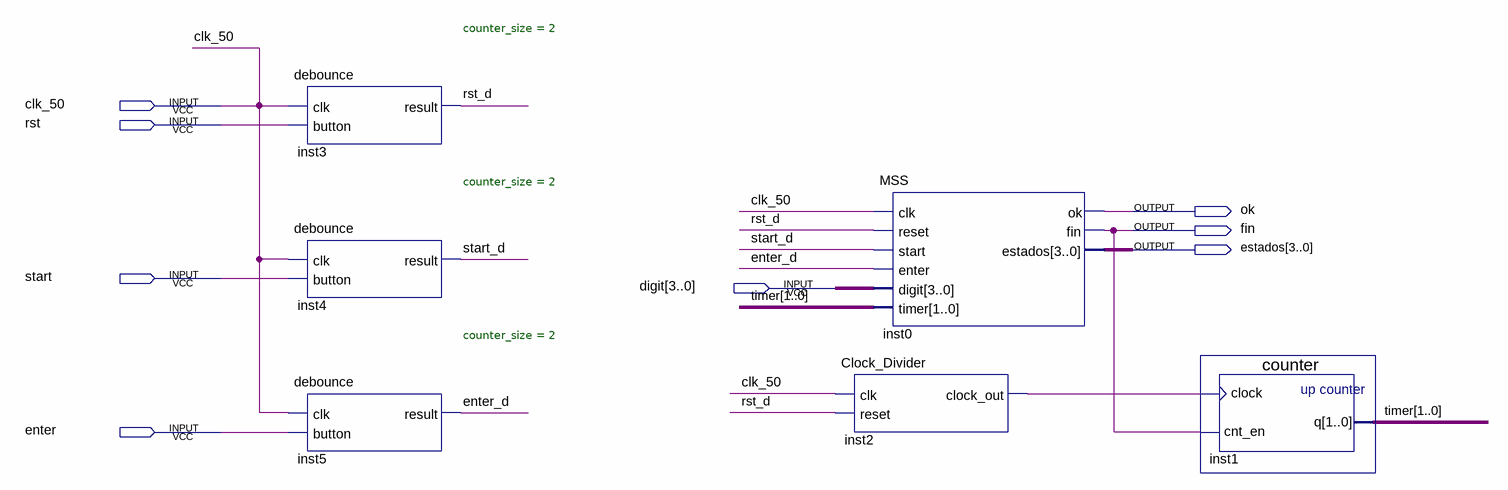
[diagram p0: schematic sheet]
// Quartus schematic VALIDACION.bdf as structural Verilog: 6 symbols, 8 pins
module VALIDACION (
  input  clk_50,
  input  rst,
  input  start,
  input  [3:0] digit,
  input  enter,
  output ok,
  output fin,
  output [3:0] estados
);

  wire enter_d, inst2_clock_out, rst_d, start_d;
  wire [1:0] timer;

  debounce #(.counter_size(2)) inst3 (.clk(clk_50), .button(rst), .result(rst_d));
  debounce #(.counter_size(2)) inst4 (.clk(clk_50), .button(start), .result(start_d));
  debounce #(.counter_size(2)) inst5 (.clk(clk_50), .button(enter), .result(enter_d));
  MSS inst0 (
    .clk(clk_50), .reset(rst_d), .start(start_d), .enter(enter_d), .digit(digit), .timer(timer), .ok(ok),
    .fin(fin), .estados(estados));
  Clock_Divider inst2 (.clk(clk_50), .reset(rst_d), .clock_out(inst2_clock_out));
  counter inst1 (.clock(inst2_clock_out), .cnt_en(fin), .q(timer));
endmodule
